# EasyEDA Pro project ProProject_XIAO_NRF52833_2024-01-15.epro, board PCB3
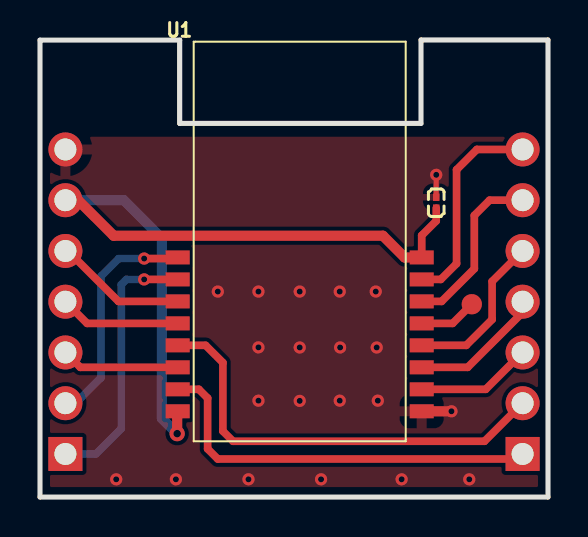
[diagram p5: board, top side]
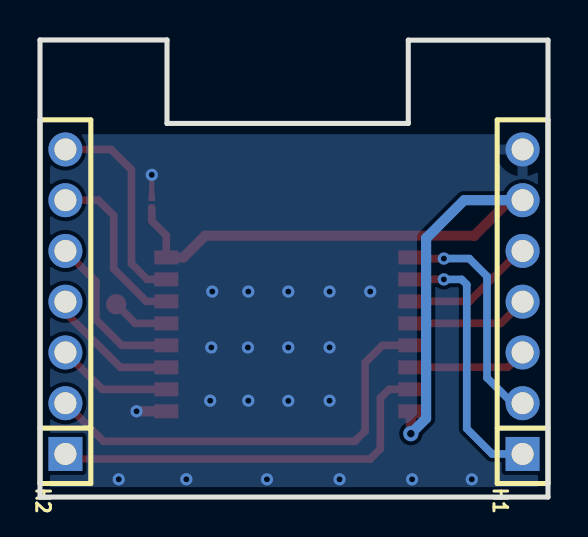
[diagram p6: board, bottom side, seen from below]

Outline 25.4 x 22.88 mm; copper layers: Top Layer, Bottom Layer. Coordinates in mm from the lower left corner of the outline.
Outline path: 0,0 0,22.87 6.99,22.87 6.99,18.7 19.05,18.7 19.05,22.88 25.4,22.88 25.4,0 0,0
Stack: Top Layer 0.035mm / Dielectric1 1.51mm FR4 er 4.5 / Bottom Layer 0.035mm

## Design rules (mm)
template: JLCPCB Capability(Two Layers Board)
spacing copperThickness1oz (default): track to track 0.102, other pairs 0.152 to 0.3
spacing copperThickness2oz: track to track 0.203, other pairs 0.152 to 0.3
track width copperThickness1oz (default): min 0.127, default 0.254, max 2.54
track width copperThickness2oz: min 0.203, default 0.254, max 2.54
differential pair differentialPair (default): width min 0.127, default 0.254, max 2.54; gap min 0.152, default 0.152
via viaSize (default): diameter min 0.5, default 0.61, max 10; hole min 0.3, default 0.305, max 6.3

## Placement (name value [footprint] x y rotation side)
C38  100nF  [C0201]  19.81 14.73 90 top
H1  PZ254V-11-07P  [HDR-TH_7P-P2.54-V-M]  1.27 9.78 90 bottom
H2  PZ254V-11-07P  [HDR-TH_7P-P2.54-V-M]  24.13 9.78 90 bottom
NOREF  -  [Pad_e284]  21.59 9.65 0 top
U1  b57178cb8c144a309b9f626ebd79fd6f  [WM02C]  6.99 2.79 0 top

## Footprints (pads in the part's own frame, mm; a bottom-side part is the same pattern mirrored in y, then rotated)
C0201
  rect 0.368x0.324 smd: 1(-0.275,0) 2(0.275,0)
HDR-TH_7P-P2.54-V-M
  rect 1.7x1.7 hole 1.1: 1(-7.62,0)
  round 1.7 hole 1.1: 2(-5.08,0) 3(-2.54,0) 4(0,0) 5(2.54,0) 6(5.08,0) 7(7.62,0)
Pad_e284
  round 1.016 smd: 1(0,0)
WM02C
  rect 1.2x0.7 smd: 1(-0.1,9.2) 2(-0.1,8.1) 3(-0.1,7) 4(-0.1,5.9) 5(-0.1,4.8) 6(-0.1,3.7) 7(-0.1,2.6) 8(-0.1,1.5) 9(12.1,1.5) 10(12.1,2.6) 11(12.1,3.7) 12(12.1,4.8) 13(12.1,5.9) 14(12.1,7) 15(12.1,8.1) 16(12.1,9.2)

## Nets
As in the schematic, except:
SW-CTRL0: NOREF.1 U1.13

## Via types
v1: diameter 0.762, hole 0.381, Top Layer to Bottom Layer, 1 via
v2: diameter 0.61, hole 0.305, Top Layer to Bottom Layer, 23 vias

## Routing (per net, layer and track width the routed paths; a pad name or vN(x,y) marks a point on that pad's centre or on a via; arc(x,y) is an arc through that point)
GND: length 2.6
  Top Layer w0.254: v2(19.81,16.13) C38.2
  Top Layer w0.508: U1.9 v2(20.57,4.29)
  vias: v2(3.81,0.89) v2(6.79,0.89) v2(8.89,10.28) v2(10.42,0.89) v2(10.92,10.28) v2(10.92,7.49) v2(10.92,4.82) v2(12.99,10.28) v2(12.99,7.49) v2(12.99,4.81) v2(14.05,0.89) v2(14.99,10.28) v2(15.01,7.49) v2(14.99,4.82) v2(16.79,10.28) v2(16.83,7.49) v2(16.89,4.82) v2(18.08,0.89) v2(21.46,0.89)
VDD: length 38.6
  Top Layer w0.381: U1.16 19.09,13.09 19.81,13.82 C38.1
  Top Layer w0.508: v1(6.86,3.17) 6.86,4.26 6.88,4.29 ; U1.16 18.23,11.99 17.15,13.08 3.68,13.08 1.91,14.86 H1.6
  Bottom Layer w0.508: H1.6 4.19,14.86 6.1,12.95 6.1,3.93 v1(6.86,3.17)
AIN0: length 20.3
  Top Layer w0.381: 6.88,5.39 7.94,5.39 8.38,4.95 8.38,2.41 8.89,1.9 23.88,1.9 H2.1
AIN2: length 22
  Top Layer w0.381: H2.2 22.22,2.79 9.65,2.79 9.14,3.3 9.14,6.73 8.28,7.59 6.88,7.59
AIN4: length 6.7
  Top Layer w0.381: U1.11 21.38,6.49 24.13,9.24 H2.4
AIN5: length 5.8
  Top Layer w0.381: 19.09,5.39 22.28,5.39 H2.3
P0.20: length 8.1
  Top Layer w0.381: U1.12 21.31,7.59 22.61,8.89 22.61,10.79 H2.5
P0.22: length 8.7
  Top Layer w0.381: U1.14 20.08,9.79 21.72,11.43 21.72,14.09 22.48,14.86 H2.6
P0.24: length 10.5
  Top Layer w0.381: 19.09,10.89 20.04,10.89 20.83,11.68 20.83,16.38 21.84,17.4 H2.7
RXD: length 11.6
  Top Layer w0.381: v2(5.21,11.94) 6.83,11.94 6.88,11.99
  Bottom Layer w0.381: H1.2 1.78,4.7 3.05,5.97 3.05,11.05 3.94,11.94 v2(5.21,11.94)
SCK1: length 5.9
  Top Layer w0.381: H1.3 2.01,6.49 6.88,6.49
SDA1: length 6.1
  Top Layer w0.381: 6.88,8.69 2.35,8.69 H1.4
SDO1: length 6.7
  Top Layer w0.381: 6.88,9.79 3.92,9.79 1.4,12.32 H1.5
SW-CTRL0: length 2.5
  Top Layer w0.381: 21.34,9.4 20.63,8.69 U1.13
TXD: length 13.5
  Top Layer w0.381: 6.88,10.89 v2(5.21,10.89)
  Bottom Layer w0.381: v2(5.21,10.89) 4.32,10.89 4.06,10.64 4.06,3.43 2.79,2.16 H1.1

## Copper pours and planes (outline as drawn; the poured copper is in the pictures)
GND on Top Layer: -1.91,18.03 26.29,18.03 26.29,-1.02 -1.4,-1.02 -1.91,-1.53
GND on Bottom Layer: 26.16,18.16 26.16,-0.76 -0.76,-0.76 -0.76,18.16
